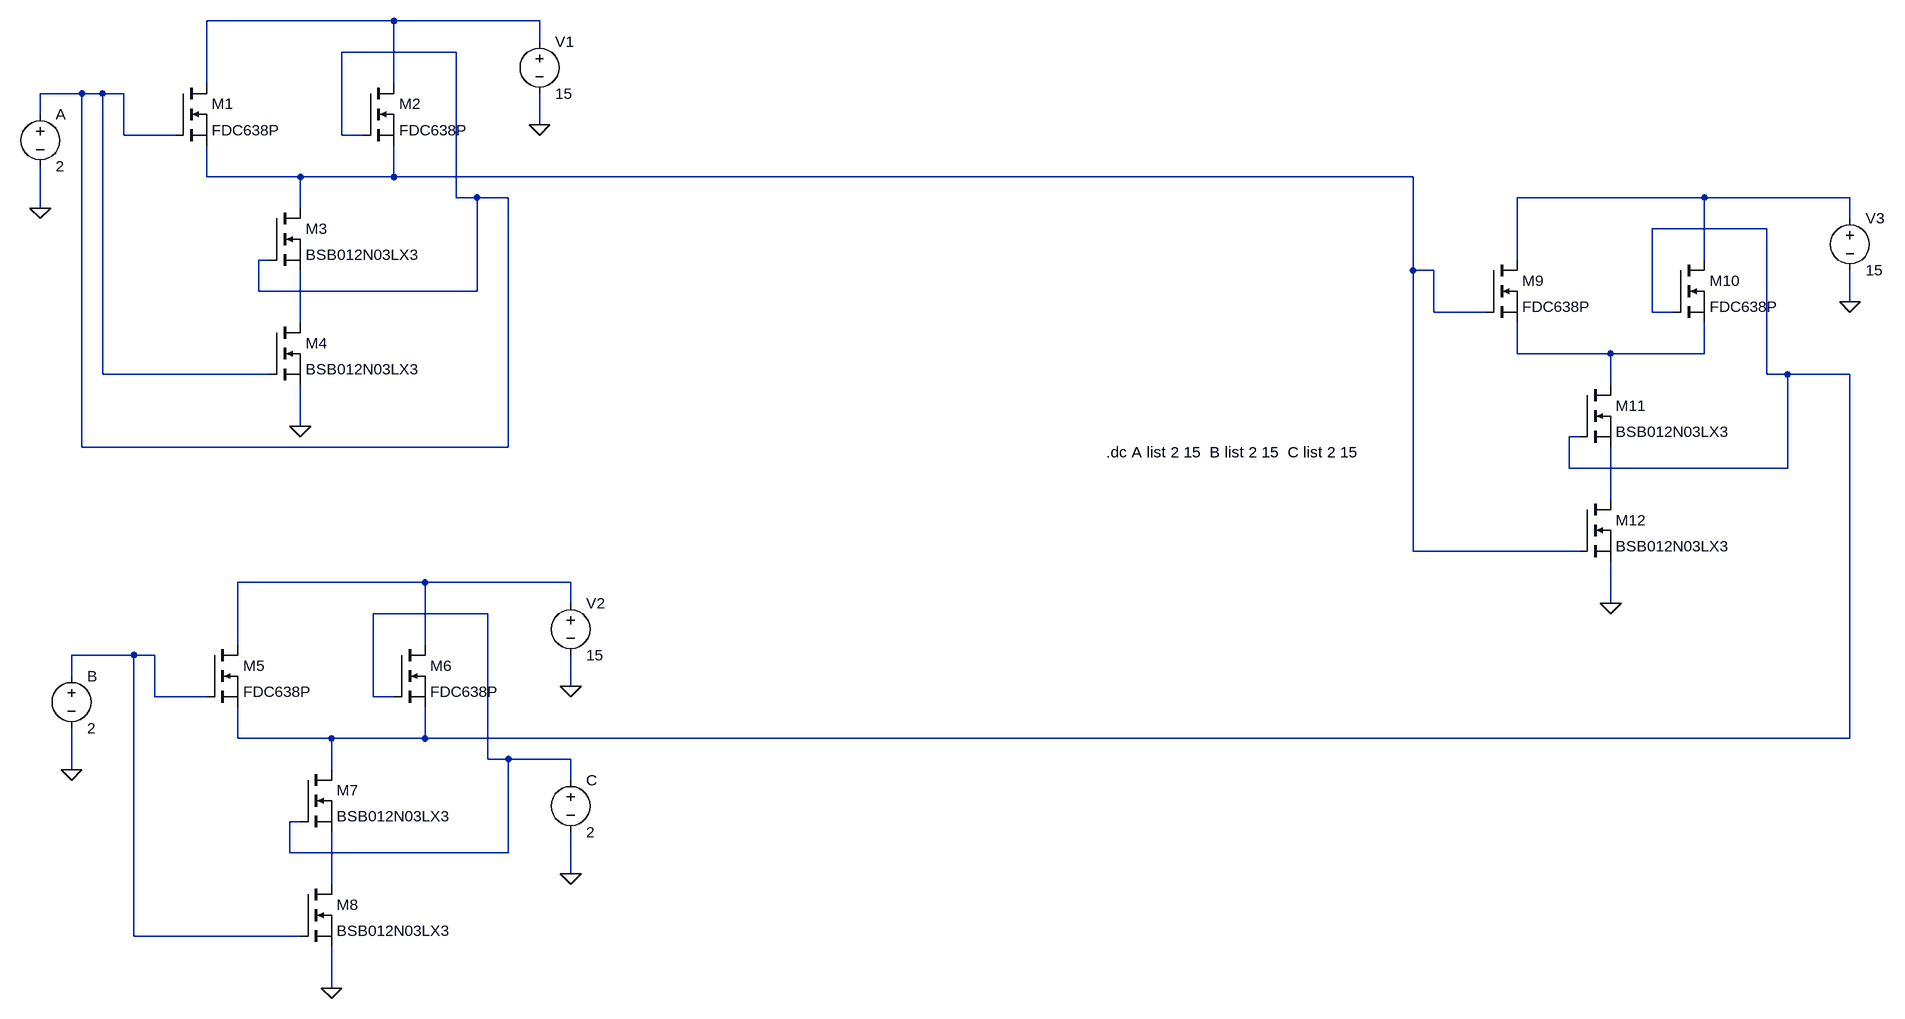
[diagram p0: schematic ECDL_MSE_UtsavPathak.asc]
ECDL_MSE_UtsavPathak.asc, the LTspice schematic file:
Version 4
SHEET 1 1900 932
WIRE -1072 -720 -1360 -720
WIRE -848 -720 -1072 -720
WIRE -848 -688 -848 -720
WIRE -976 -672 -1152 -672
WIRE -1360 -624 -1360 -720
WIRE -1072 -624 -1072 -720
WIRE -1552 -608 -1616 -608
WIRE -1520 -608 -1552 -608
WIRE -1488 -608 -1520 -608
WIRE -1616 -576 -1616 -608
WIRE -848 -560 -848 -608
WIRE -1488 -544 -1488 -608
WIRE -1408 -544 -1488 -544
WIRE -1152 -544 -1152 -672
WIRE -1120 -544 -1152 -544
WIRE -1360 -480 -1360 -528
WIRE -1216 -480 -1360 -480
WIRE -1072 -480 -1072 -528
WIRE -1072 -480 -1216 -480
WIRE 496 -480 -1072 -480
WIRE -976 -448 -976 -672
WIRE -944 -448 -976 -448
WIRE -896 -448 -944 -448
WIRE 944 -448 656 -448
WIRE 1168 -448 944 -448
WIRE -1616 -432 -1616 -496
WIRE -1216 -432 -1216 -480
WIRE 1168 -416 1168 -448
WIRE 1040 -400 864 -400
WIRE -1264 -352 -1280 -352
WIRE 656 -352 656 -448
WIRE 944 -352 944 -448
WIRE 496 -336 496 -480
WIRE 528 -336 496 -336
WIRE -1280 -304 -1280 -352
WIRE -944 -304 -944 -448
WIRE -944 -304 -1280 -304
WIRE 1168 -288 1168 -336
WIRE 528 -272 528 -336
WIRE 608 -272 528 -272
WIRE 864 -272 864 -400
WIRE 896 -272 864 -272
WIRE -1216 -256 -1216 -336
WIRE 656 -208 656 -256
WIRE 800 -208 656 -208
WIRE 944 -208 944 -256
WIRE 944 -208 800 -208
WIRE -1520 -176 -1520 -608
WIRE -1264 -176 -1520 -176
WIRE 1040 -176 1040 -400
WIRE 1072 -176 1040 -176
WIRE 1168 -176 1072 -176
WIRE 800 -160 800 -208
WIRE -1216 -96 -1216 -160
WIRE 752 -80 736 -80
WIRE -1552 -64 -1552 -608
WIRE -896 -64 -896 -448
WIRE -896 -64 -1552 -64
WIRE 736 -32 736 -80
WIRE 1072 -32 1072 -176
WIRE 1072 -32 736 -32
WIRE 800 16 800 -64
WIRE 496 96 496 -336
WIRE 752 96 496 96
WIRE -1024 144 -1312 144
WIRE -800 144 -1024 144
WIRE -800 176 -800 144
WIRE 800 176 800 112
WIRE -928 192 -1104 192
WIRE -1312 240 -1312 144
WIRE -1024 240 -1024 144
WIRE -1472 256 -1568 256
WIRE -1440 256 -1472 256
WIRE -1568 288 -1568 256
WIRE -800 304 -800 256
WIRE -1440 320 -1440 256
WIRE -1360 320 -1440 320
WIRE -1104 320 -1104 192
WIRE -1072 320 -1104 320
WIRE -1312 384 -1312 336
WIRE -1168 384 -1312 384
WIRE -1024 384 -1024 336
WIRE -1024 384 -1168 384
WIRE 1168 384 1168 -176
WIRE 1168 384 -1024 384
WIRE -928 416 -928 192
WIRE -896 416 -928 416
WIRE -800 416 -896 416
WIRE -1568 432 -1568 368
WIRE -1168 432 -1168 384
WIRE -800 448 -800 416
WIRE -1216 512 -1232 512
WIRE -1232 560 -1232 512
WIRE -896 560 -896 416
WIRE -896 560 -1232 560
WIRE -800 592 -800 528
WIRE -1168 608 -1168 528
WIRE -1472 688 -1472 256
WIRE -1216 688 -1472 688
WIRE -1168 768 -1168 704
FLAG -1616 -432 0
FLAG -848 -560 0
FLAG -1216 -96 0
FLAG -1568 432 0
FLAG -800 304 0
FLAG -1168 768 0
FLAG 1168 -288 0
FLAG 800 176 0
FLAG -800 592 0
SYMBOL nmos -1408 -624 R0
SYMATTR InstName M1
SYMATTR Value FDC638P
SYMBOL nmos -1120 -624 R0
SYMATTR InstName M2
SYMATTR Value FDC638P
SYMBOL nmos -1264 -432 R0
SYMATTR InstName M3
SYMATTR Value BSB012N03LX3
SYMBOL nmos -1264 -256 R0
SYMATTR InstName M4
SYMATTR Value BSB012N03LX3
SYMBOL voltage -848 -704 R0
SYMATTR InstName V1
SYMATTR Value 15
SYMBOL voltage -1616 -592 R0
SYMATTR InstName A
SYMATTR Value 2
SYMBOL nmos -1360 240 R0
SYMATTR InstName M5
SYMATTR Value FDC638P
SYMBOL nmos -1072 240 R0
SYMATTR InstName M6
SYMATTR Value FDC638P
SYMBOL nmos -1216 432 R0
SYMATTR InstName M7
SYMATTR Value BSB012N03LX3
SYMBOL nmos -1216 608 R0
SYMATTR InstName M8
SYMATTR Value BSB012N03LX3
SYMBOL voltage -800 160 R0
SYMATTR InstName V2
SYMATTR Value 15
SYMBOL voltage -1568 272 R0
SYMATTR InstName B
SYMATTR Value 2
SYMBOL nmos 608 -352 R0
SYMATTR InstName M9
SYMATTR Value FDC638P
SYMBOL nmos 896 -352 R0
SYMATTR InstName M10
SYMATTR Value FDC638P
SYMBOL nmos 752 -160 R0
SYMATTR InstName M11
SYMATTR Value BSB012N03LX3
SYMBOL nmos 752 16 R0
SYMATTR InstName M12
SYMATTR Value BSB012N03LX3
SYMBOL voltage 1168 -432 R0
SYMATTR InstName V3
SYMATTR Value 15
SYMBOL voltage -800 432 R0
SYMATTR InstName C
SYMATTR Value 2
TEXT 24 -56 Left 2 !.dc A list 2 15  B list 2 15  C list 2 15

The netlist it stands for:
* ECDL_MSE_UtsavPathak.asc
M1 N001 N002 N003 N003 FDC638P
M2 N001 N002 N003 N003 FDC638P
M3 N003 N002 N006 N006 BSB012N03LX3
M4 N006 N002 0 0 BSB012N03LX3
V1 N001 0 15
V§A N002 0 2
M5 N009 N011 N005 N005 FDC638P
M6 N009 N010 N005 N005 FDC638P
M7 N005 N010 N012 N012 BSB012N03LX3
M8 N012 N011 0 0 BSB012N03LX3
V2 N009 0 15
V§B N011 0 2
M9 N004 N003 N007 N007 FDC638P
M10 N004 N005 N007 N007 FDC638P
M11 N007 N005 N008 N008 BSB012N03LX3
M12 N008 N003 0 0 BSB012N03LX3
V3 N004 0 15
V§C N010 0 2
.model NMOS NMOS
.model PMOS PMOS
.lib standard.mos
.dc A list 2 15  B list 2 15  C list 2 15
.backanno
.end